# EAGLE design LEDnecklaceW (EAGLE 6.4)
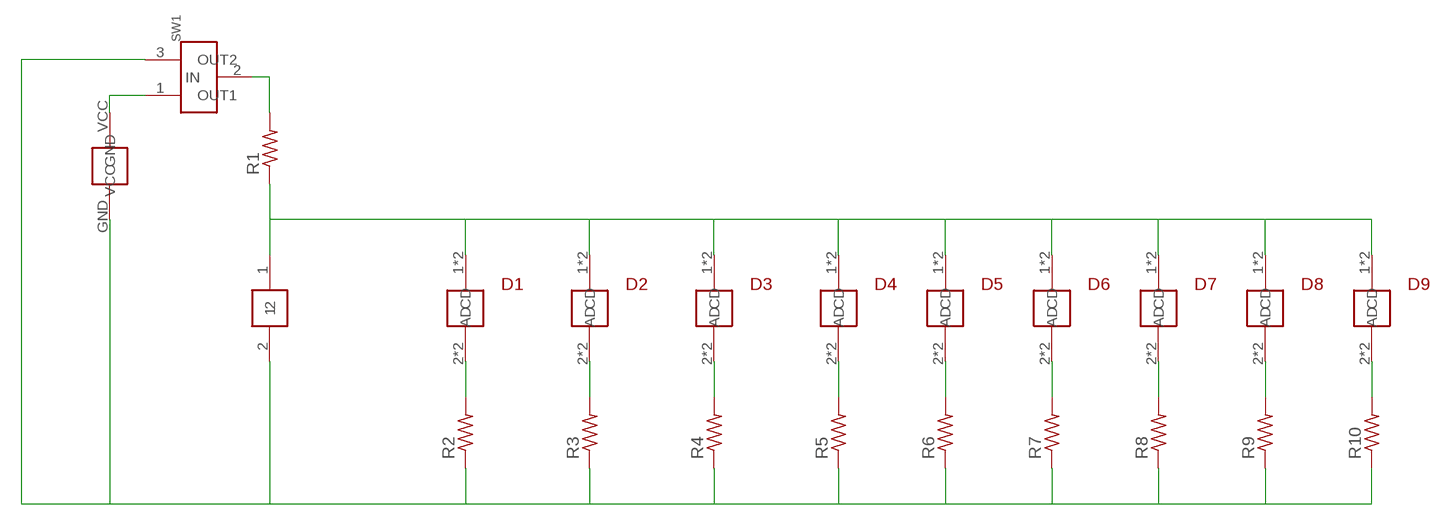
[diagram p0: schematic, sheet 1]

## Parts
D1  SZA05A0A  [SZA05A0A]
D2  SZA05A0A  [SZA05A0A]
D3  SZA05A0A  [SZA05A0A]
D4  SZA05A0A  [SZA05A0A]
D5  SZA05A0A  [SZA05A0A]
D6  SZA05A0A  [SZA05A0A]
D7  SZA05A0A  [SZA05A0A]
D8  SZA05A0A  [SZA05A0A]
D9  SZA05A0A  [SZA05A0A]
P1  BU2032SM-BT-GCT  [SMD_BATT_HOLDER_2032]
PC1  PDV-P8101  [PHOTOCELL_CERAMIC]
R1  R-US_R0603  [R0603]
R2  R-US_R0603  [R0603]
R3  R-US_R0603  [R0603]
R4  R-US_R0603  [R0603]
R5  R-US_R0603  [R0603]
R6  R-US_R0603  [R0603]
R7  R-US_R0603  [R0603]
R8  R-US_R0603  [R0603]
R9  R-US_R0603  [R0603]
R10  R-US_R0603  [R0603]
SW1  PCM12SMTR  [PCM12SMTR]

## Nets
N$1: R1.2 SW1.2(IN)
N$2: P1.GND PC1.2 R2.1 R3.1 R4.1 R5.1 R6.1 R7.1 R8.1 R9.1 R10.1 SW1.3(OUT2)
N$5: D1.2(CD) D1.12(CD) R2.2
N$6: P1.VCC SW1.1(OUT1)
N$7: D2.2(CD) D2.12(CD) R3.2
N$8: D3.2(CD) D3.12(CD) R4.2
N$9: D4.2(CD) D4.12(CD) R5.2
N$10: D5.2(CD) D5.12(CD) R6.2
N$11: D6.2(CD) D6.12(CD) R7.2
N$12: D7.2(CD) D7.12(CD) R8.2
N$13: D8.2(CD) D8.12(CD) R9.2
N$14: D9.2(CD) D9.12(CD) R10.2
N$15: D1.1(AD) D1.11(AD) D2.1(AD) D2.11(AD) D3.1(AD) D3.11(AD) D4.1(AD) D4.11(AD) D5.1(AD) D5.11(AD) D6.1(AD) D6.11(AD) D7.1(AD) D7.11(AD) D8.1(AD) D8.11(AD) D9.1(AD) D9.11(AD) PC1.1 R1.1

## Library data of the parts
D1-D9 = freddyLibr:SZA05A0A: 2 pin SMD LED from Seoul Semiconductors.
P1 = freddyLibr:BU2032SM-BT-GCT: SMD 20.0 mm coin battery holder.
PC1 = freddyLibr:PDV-P8101: Photocell in ceramic package
R1-R10 = resistor:R-US_: RESISTOR, American symbol
SW1 = freddyLibr:PCM12SMTR: Three pin switch. Horizontal gull wing surface mount.

## Board
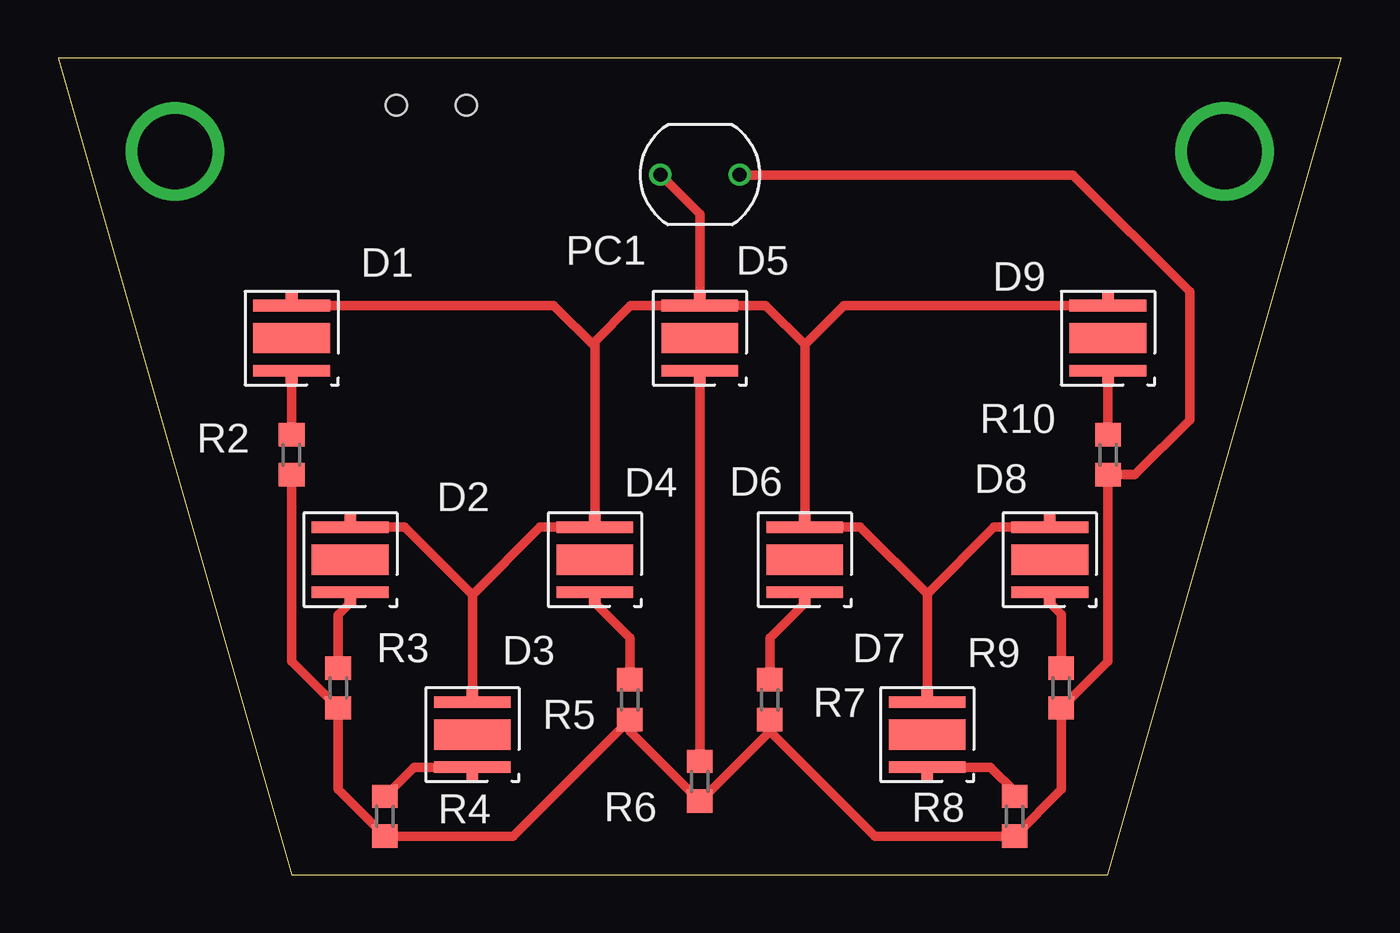
[diagram p1: board, top side]
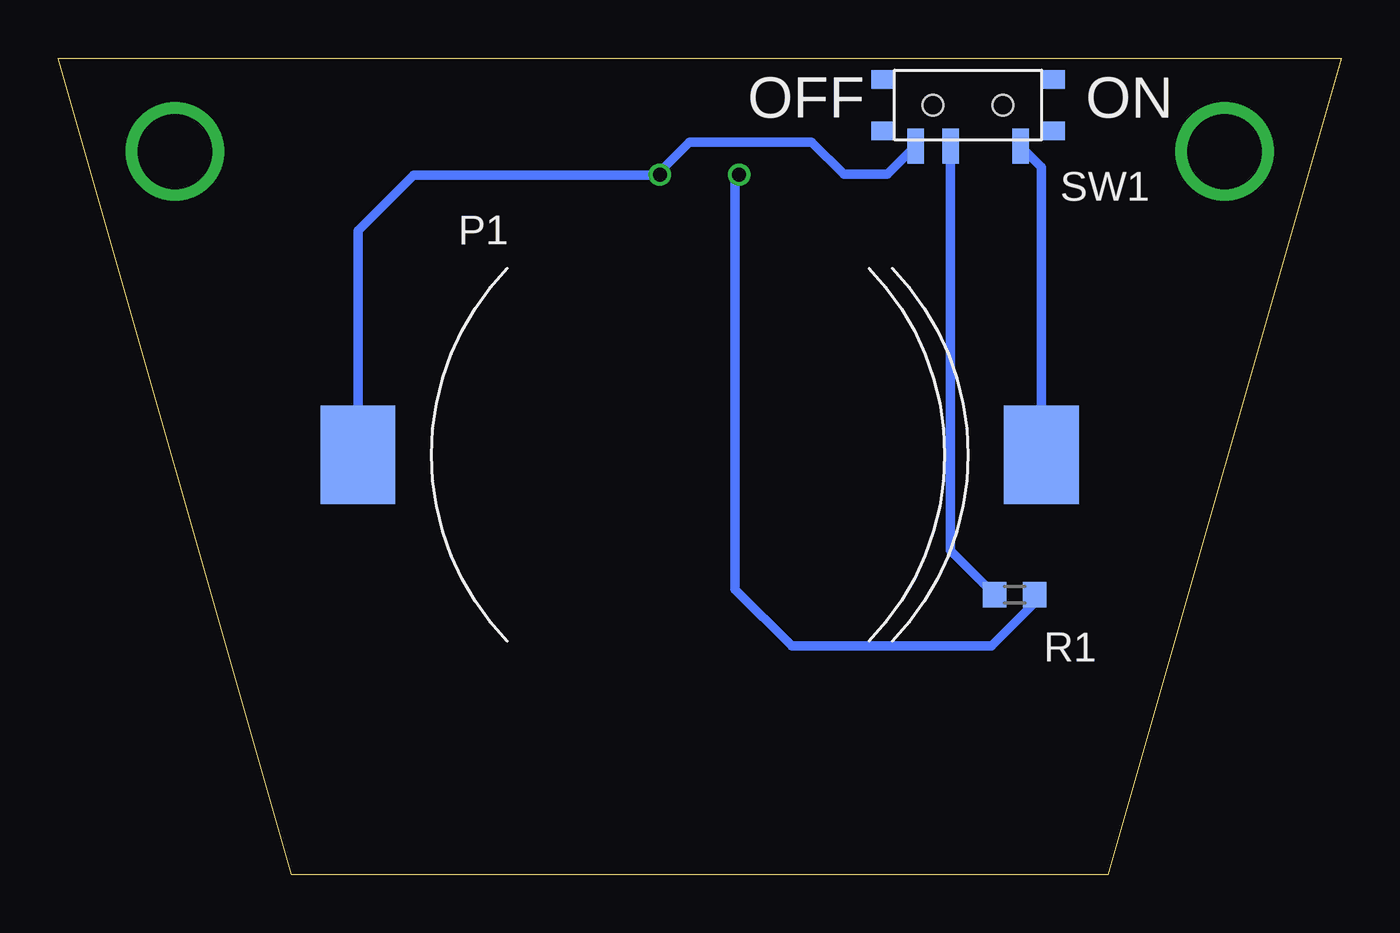
[diagram p2: board, bottom side, seen from below]

Size 55 x 35 mm. Coordinates in mm from the lower left corner, seen from the top.
Outline: 10,0 45,0 55,35 0,35 10,0
Copper layers (1*16): Top 0.0356mm / dielectric 1.5011mm / Bottom 0.0356mm
Design rules "LaenPCBOrder": minimum track width 6mil, minimum drill 13mil, track to track 6mil, track to pad 6mil, pad to pad 6mil, via to via 6mil, smd to smd 6mil, copper to edge 15mil, drill to drill 6mil, minimum pad ring 7mil, minimum via ring 7mil, stop-mask expansion 3mil, vias tented up to drill 0mil, thermal gap 10mil

### Footprints (pad centres in the part's own frame; a part is rotated, then mirrored left to right if it is on the bottom)
SZA05A0A = smd 0.5 x 3.3: 1 -1.4,0; 2 1.4,0 | smd 1.3 x 3.3: 3 0,0 | smd 0.4 x 0.5: 11 -1.85,0; 12 1.85,0
SMD_BATT_HOLDER_2032 = smd 3.2 x 4.2: GND 14.65,0; VCC -14.65,0
PHOTOCELL_CERAMIC = drill 0.6: 1 0,1.7; 2 0,-1.7
R0603 = smd 1 x 1.1: 1 -0.85,0; 2 0.85,0
PCM12SMTR = smd 0.7 x 1.5: 1 -2.25,1.75; 2 0.75,1.75; 3 2.25,1.75 | smd 1 x 0.8: 4 -3.65,1.1; 5 -3.65,-1.1; 6 3.65,1.1; 7 3.65,-1.1 | hole 0.9: -1.5,0; 1.5,0

### Placement (x,y rotation side)
D1  10,23 270 top
D2  12.52,13.5 270 top
D3  17.75,6 270 top
D4  23,13.5 270 top
D5  27.5,23 270 top
D6  32,13.5 270 top
D7  37.25,6 270 top
D8  42.5,13.5 270 top
D9  45,23 270 top
P1  27.5,18 180 bottom
PC1  27.51,30.01 90 top
R1  14,12 180 bottom
R2  10,18 90 top
R3  12,8 90 top
R4  14,2.5 90 top
R5  24.5,7.5 90 top
R6  27.5,4 90 top
R7  30.5,7.5 90 top
R8  41,2.5 90 top
R9  43,8 90 top
R10  45,18 90 top
SW1  16,32.99 180 bottom

### Tracks (layer width: path | path; a pad name or v marks a point on that pad's centre or on a via)
N$1
  Bottom 0.406: SW1.2 16.75,13.9 R1.2
N$2
  Top 0.406: R2.1 10,9.15 R3.1 12,3.65 R4.1 19.5,1.65 R5.1 24.5,6.15 R6.1 30.5,6.15 | R7.1 30.5,6.15 | 30.5,6.15 35,1.65 R8.1 43,3.65 R9.1 45,9.15 R10.1 46.15,17.15 48.5,19.5 48.5,25 43.5,30 PC1.2
  Bottom 0.406: P1.GND 42.15,27.62 39.77,30 PC1.2 29.21,30.13 27.93,31.41 22.7,31.41 21.32,30.03 19.46,30.03 SW1.3
N$3  (via drill 3.2 pad 2.54)
  other vias: 5,31
N$4  (via drill 3.2 pad 2.54)
  other vias: 50,31
N$5
  Top 0.406: D1.2 D1.12 R2.2
N$6
  Bottom 0.406: P1.VCC 12.85,30.34 SW1.1
N$7
  Top 0.406: D2.2 D2.12 12,11.13 R3.2
N$8
  Top 0.406: D3.12 D3.2 15.25,4.6 R4.2
N$9
  Top 0.406: D4.2 D4.12 24.5,10.15 R5.2
N$10
  Top 0.406: D5.2 D5.12 R6.2
N$11
  Top 0.406: D6.2 D6.12 30.5,10.15 R7.2
N$12
  Top 0.406: D7.12 D7.2 39.97,4.6 41,3.57 R8.2
N$13
  Top 0.406: D8.2 D8.12 43,11.15 R9.2
N$14
  Top 0.406: D9.2 D9.12 R10.2
N$15
  Top 0.406: D1.11 D1.1 21.23,24.4 23,22.63 | D2.11 D2.1 14.85,14.9 17.75,12 | D3.1 D3.11 17.75,12 | D5.1 D5.11 27.5,28.32 PC1.1 | D6.11 D6.1 | D7.1 D7.11 37.25,12.03 | D8.11 D8.1 40.12,14.9 37.25,12.03 | D9.11 D9.1 33.68,24.4 32,22.72 | 17.75,12 20.65,14.9 D4.1 D4.11 23,22.63 | 23,22.63 23,22.86 24.54,24.4 D5.1 | D6.1 32,22.72 | 32,22.72 30.32,24.4 D5.1 | 37.25,12.03 34.37,14.91 D6.1
  Bottom 0.406: R1.1 13.15,11.64 14.99,9.8 23.55,9.8 25.98,12.23 25.98,29.84 PC1.1

### Text on the board
bPlace: ON | OFF